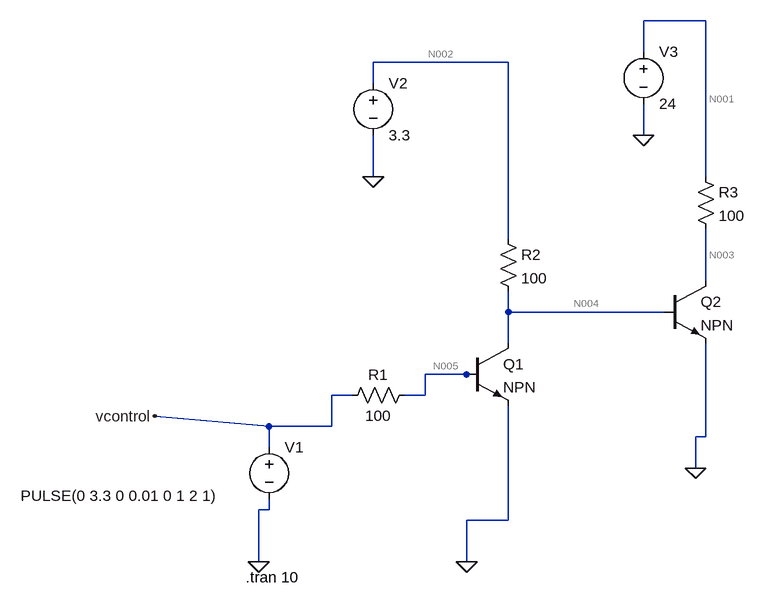
[diagram p0: schematic Draft2.asc]
Draft2.asc, the LTspice schematic file:
Version 4
SHEET 1 984 680
WIRE 336 -688 240 -688
WIRE 240 -640 240 -688
WIRE 32 -624 -176 -624
WIRE -176 -592 -176 -624
WIRE 240 -512 240 -560
WIRE -176 -448 -176 -512
WIRE 336 -448 336 -688
WIRE 32 -352 32 -624
WIRE 336 -288 336 -368
WIRE 32 -240 32 -272
WIRE 272 -240 32 -240
WIRE 32 -192 32 -240
WIRE -32 -144 -96 -144
WIRE -16 -144 -32 -144
WIRE -208 -112 -240 -112
WIRE -96 -112 -96 -144
WIRE -96 -112 -128 -112
WIRE -336 -64 -512 -80
WIRE -240 -64 -240 -112
WIRE -240 -64 -336 -64
WIRE 336 -48 336 -192
WIRE 336 -48 320 -48
WIRE -336 -32 -336 -64
WIRE 320 0 320 -48
WIRE -336 64 -336 48
WIRE -336 64 -352 64
WIRE 32 80 32 -96
WIRE 32 80 -32 80
WIRE -352 144 -352 64
WIRE -32 144 -32 80
FLAG -352 144 0
FLAG -512 -80 vcontrol
FLAG -32 144 0
FLAG -176 -448 0
FLAG 320 0 0
FLAG 240 -512 0
SYMBOL voltage -336 -48 R0
WINDOW 3 -382 91 Left 2
WINDOW 123 0 0 Left 0
WINDOW 39 0 0 Left 0
SYMATTR InstName V1
SYMATTR Value PULSE(0 3.3 0 0.01 0 1 2 1)
SYMBOL res -112 -128 R90
WINDOW 0 0 56 VBottom 2
WINDOW 3 32 56 VTop 2
SYMATTR InstName R1
SYMATTR Value 100
SYMBOL res 16 -368 R0
SYMATTR InstName R2
SYMATTR Value 100
SYMBOL npn -32 -192 R0
SYMATTR InstName Q1
SYMBOL voltage -176 -608 R0
WINDOW 123 0 0 Left 0
WINDOW 39 0 0 Left 0
SYMATTR InstName V2
SYMATTR Value 3.3
SYMBOL npn 272 -288 R0
SYMATTR InstName Q2
SYMBOL res 320 -464 R0
SYMATTR InstName R3
SYMATTR Value 100
SYMBOL voltage 240 -656 R0
WINDOW 123 0 0 Left 0
WINDOW 39 0 0 Left 0
SYMATTR InstName V3
SYMATTR Value 24
TEXT -372 168 Left 2 !.tran 10

The netlist it stands for:
* Draft2.asc
V1 vcontrol 0 PULSE(0 3.3 0 0.01 0 1 2 1)
R1 N005 vcontrol 100
R2 N002 N004 100
Q1 N004 N005 0 0 NPN
V2 N002 0 3.3
Q2 N003 N004 0 0 NPN
R3 N001 N003 100
V3 N001 0 24
.model NPN NPN
.model PNP PNP
.lib standard.bjt
.tran 10
.backanno
.end

* Results of the author's LTspice run, read from the files saved beside the schematic
* Operating Point, zero values left out:
*   V(n002) = 3.3 V
*   V(n004) = 920.1 mV
*   V(n003) = 67.13 mV
*   V(n001) = 24 V
*   Ic(Q2) = 239.3 mA
*   Ib(Q2) = 23.8 mA
*   Ie(Q2) = -263.1 mA
*   I(R3) = 239.3 mA
*   I(R2) = 23.8 mA
*   I(V3) = -239.3 mA
*   I(V2) = -23.8 mA
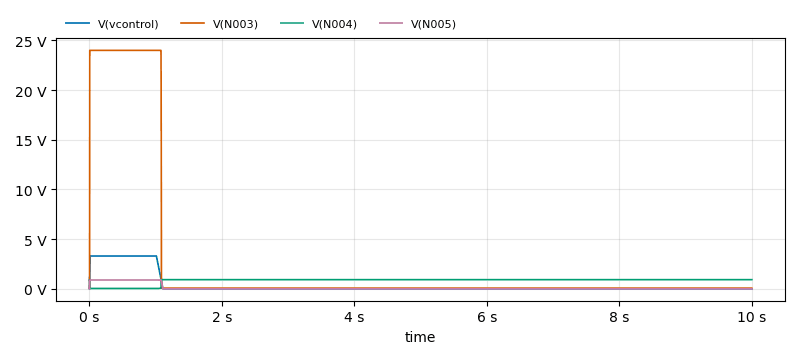
[diagram p1: Transient Analysis of Draft2.asc, plotted from the saved traces]
* Transient Analysis, 1 run:
*   V(vcontrol): min 0 V, max 3.3 V, average 348 mV, rms 1.062 V, last 0 V
*   V(N003): min 67.13 mV, max 24 V, average 2.655 V, rms 7.889 V, last 67.13 mV
*   V(N004): min 31.66 mV, max 920.1 mV, average 824.3 mV, rms 869 mV, last 920.1 mV
*   V(N005): min 0 V, max 887.4 mV, average 96.98 mV, rms 292.6 mV, last 0 V